# EAGLE schematic ControllerBoard (EAGLE 9.6.2)
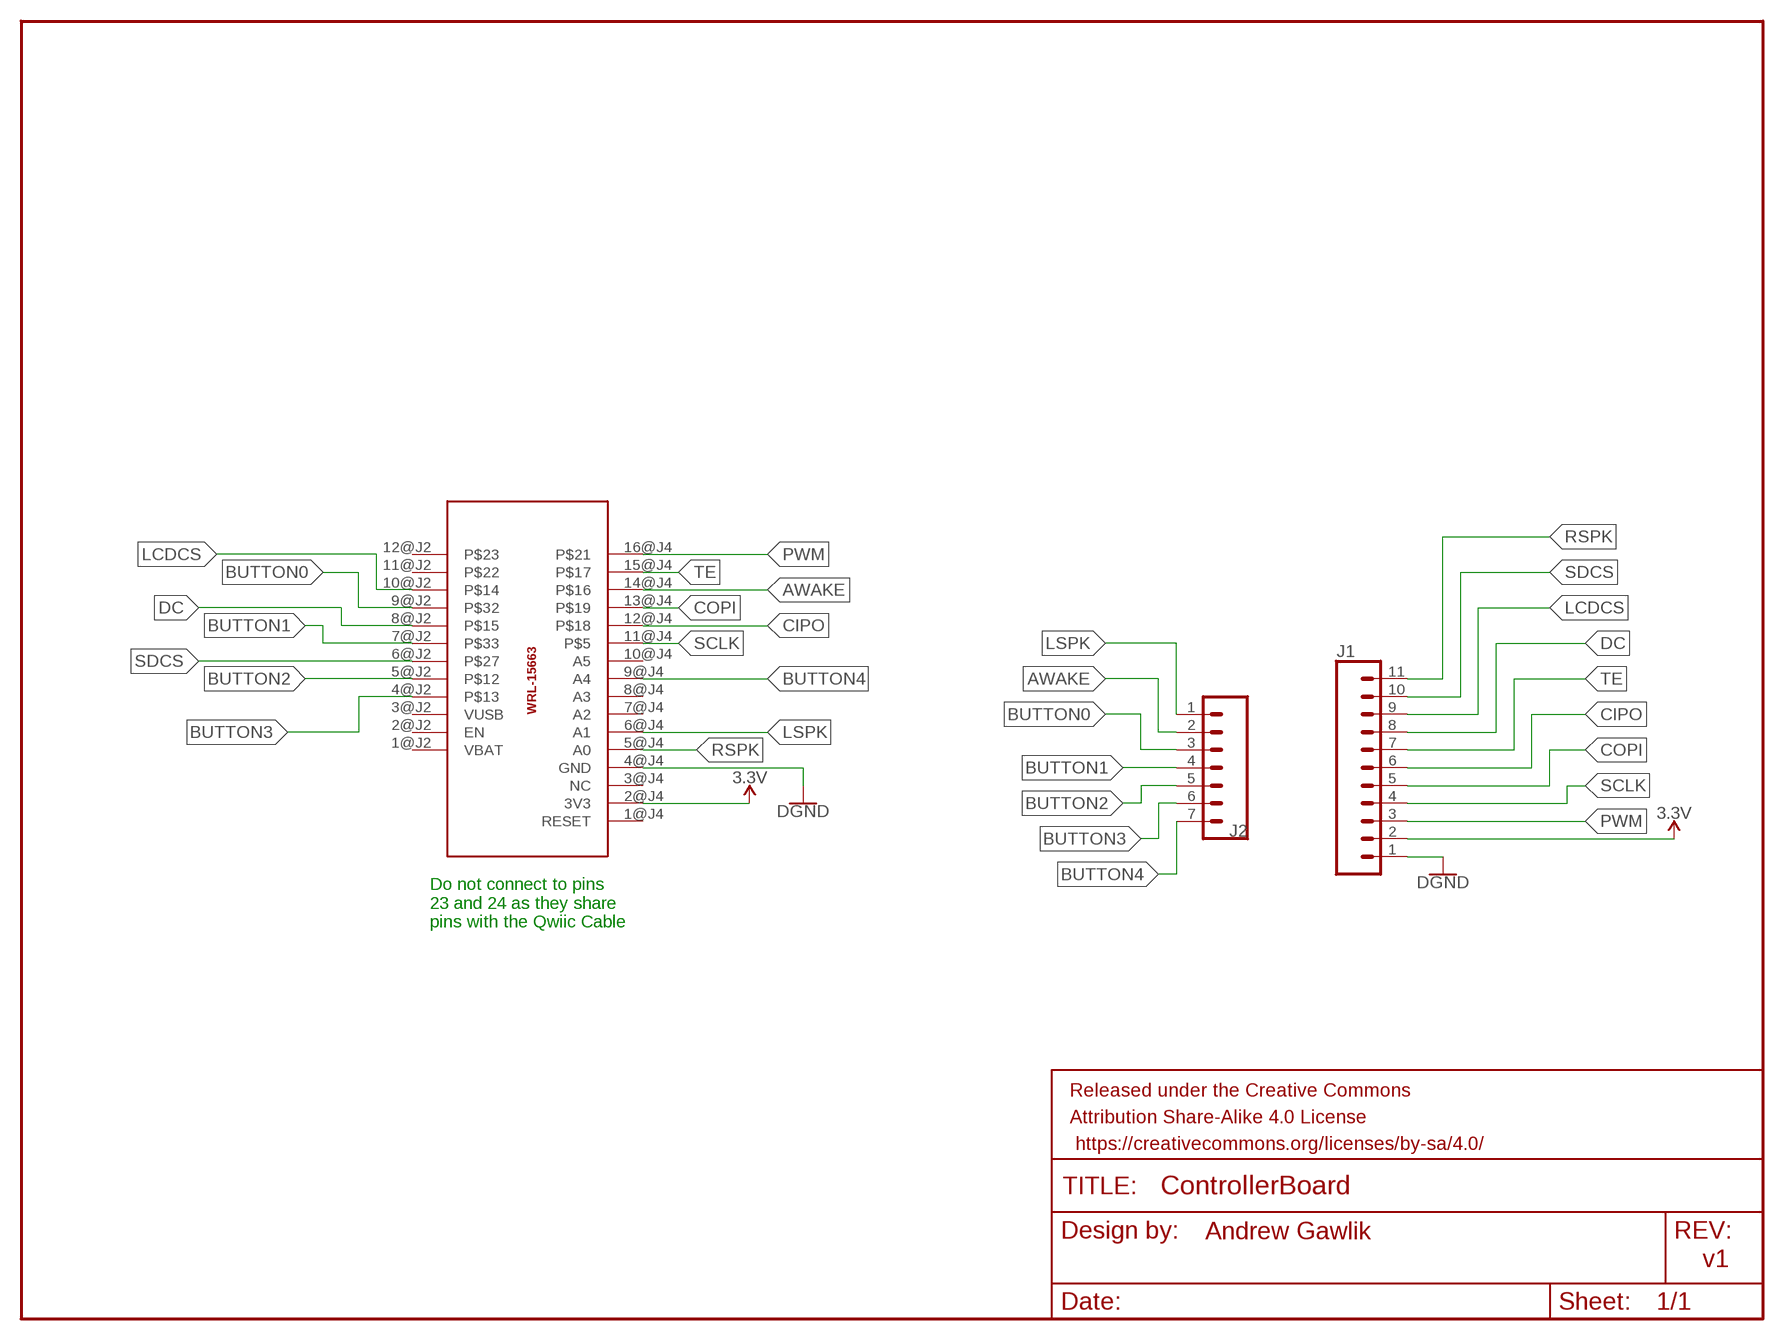
[diagram p0: schematic, sheet 1]

## Parts
A1  ESP32_MICROCONTROLLER  WRL-17381  [WRL-17381]
FRAME1  FRAME-LETTER  [CREATIVE_COMMONS]
J1  CONN_11LOCK  [1X11_LOCK]
J2  CONN_07LOCK  [1X07_LOCK]

## Nets
3.3V: A1.2@J4(3V3) J1.2
AWAKE: A1.14@J4 J2.2
BUTTON0: A1.9@J2 J2.3
BUTTON1: A1.7@J2 J2.4
BUTTON2: A1.5@J2 J2.5
BUTTON3: A1.4@J2 J2.6
BUTTON4: A1.9@J4(A4) J2.7
CIPO: A1.12@J4 J1.6
COPI: A1.13@J4 J1.5
DC: A1.8@J2 J1.8
GND: A1.4@J4(GND) J1.1 ; supply symbol labelled DGND
LCDCS: A1.10@J2 J1.9
LSPK: A1.6@J4(A1) J2.1
PWM: A1.16@J4 J1.3
RSPK: A1.5@J4(A0) J1.11
SCLK: A1.11@J4 J1.4
SDCS: A1.6@J2 J1.10
TE: A1.15@J4 J1.7
Unconnected: A1.1@J2(VBAT) A1.1@J4(RESET) A1.2@J2(EN) A1.3@J2(VUSB) A1.3@J4(NC) A1.7@J4(A2) A1.8@J4(A3) A1.10@J4(A5) A1.11@J2 A1.12@J2

## Notes on the sheet
- Do not connect to pins
  23 and 24 as they share
  pins with the Qwiic Cable
- Andrew Gawlik
- v1

## Library data of the parts
A1 = SparkFunBreakouts:WRL-17381: SparkFun Thing Plus - ESP32 WROOM (U.FL) The SparkFun ESP32 Thing Plus with U.FL is the next step to get started with Espressif IoT ideations while still enjoying all the amenities of the original ESP32 Thing. Espressif's ESP32 WROOM is a powerful WiFi and Bluetooth MCU module that targets a wide variety of applications. At the core of this module is the ESP32-D0WDQ6 chip which is designed to be both scalable and adaptive. To make the Thing Plus even easier to use, we've moved a few pins around to make the board Feather compatible and it utilizes our handy Qwiic Connect System which means no soldering or shields are required to connect it to the rest of your system! Why the name? We lovingly call it the “Thing” because it's the perfect foundation for your Internet of Things project. The Thing does everything from turning on an LED to posting data with your chosen platform, and can be programmed just like any microcontroller. You can even program the Thing through the Arduino IDE by installing the updated ESP32 Arduino Core <https://learn.sparkfun.com/tutorials/esp32-thing-plus-hookup-guide?_ga=2.27845048.500067859.1617115070-1450422450.1611246352#software-setup>. The ESP32 Thing plus integrates a rich set of peripherals, ranging from capacitive touch sensors, Hall sensors, SD card interface, Ethernet, high-speed SPI, UART, I2S and I2C. Thanks to the onboard ESP32 WROOM module, the SparkFun Thing Plus features 16MB of flash memory, 520kB of internal SRAM, an integrated 802.11 BGN WiFi transceiver and dual-mode Bluetooth capabilities, a JST connector to plug in a LiPo battery, and a U.FL connector for your own antenna. The SparkFun Qwiic Connect System is an ecosystem of I2C sensors, actuators, shields and cables that make prototyping faster and less prone to error. All Qwiic-enabled boards use a common 1mm pitch, 4-pin JST connector. This reduces the amount of required PCB space, and polarized connections mean you can’t hook it up wrong.
FRAME1 = SparkFun-Aesthetics:FRAME-LETTER: Schematic Frame - Letter Standard 8.5x11 US Letter frame
J1 = SparkFun-Connectors:CONN_11: Multi connection point. Often used as Generic Header-pin footprint for 0.1 inch spaced/style header connections On any of the 0.1 inch spaced packages, you can populate with these: Break Away Headers - Straight <https://www.sparkfun.com/products/116> (PRT-00116) Break Away Male Headers - Right Angle <https://www.sparkfun.com/products/553> (PRT-00553) Female Headers <https://www.sparkfun.com/products/115> (PRT-00115) Break Away Headers - Machine Pin <https://www.sparkfun.com/products/117> (PRT-00117) Break Away Female Headers - Swiss Machine Pin <https://www.sparkfun.com/products/743> (PRT-00743) For SCREWTERMINALS and SPRING TERMINALS visit here: Screw Terimnals on SparkFun.com <https://www.sparkfun.com/search/results?term=Screw+Terminals> (5mm/3.5mm/2.54mm spacing) This device is also useful as a general connection point to wire up your design to another part of your project. Our various solder wires solder well into these plated through hole pads. Hook-Up Wire - Assortment (Stranded, 22 AWG) <https://www.sparkfun.com/products/11375> (PRT-11375) Hook-Up Wire - Assortment (Solid Core, 22 AWG) <https://www.sparkfun.com/products/11367> (PRT-11367) View the entire wire category on our website here <https://www.sparkfun.com/categories/141>
J2 = SparkFun-Connectors:CONN_07: Multi connection point. Often used as Generic Header-pin footprint for 0.1 inch spaced/style header connections On any of the 0.1 inch spaced packages, you can populate with these: Break Away Headers - Straight <https://www.sparkfun.com/products/116> (PRT-00116) Break Away Male Headers - Right Angle <https://www.sparkfun.com/products/553> (PRT-00553) Female Headers <https://www.sparkfun.com/products/115> (PRT-00115) Break Away Headers - Machine Pin <https://www.sparkfun.com/products/117> (PRT-00117) Break Away Female Headers - Swiss Machine Pin <https://www.sparkfun.com/products/743> (PRT-00743) For SCREWTERMINALS and SPRING TERMINALS visit here: Screw Terimnals on SparkFun.com <https://www.sparkfun.com/search/results?term=Screw+Terminals> (5mm/3.5mm/2.54mm spacing) This device is also useful as a general connection point to wire up your design to another part of your project. Our various solder wires solder well into these plated through hole pads. Hook-Up Wire - Assortment (Stranded, 22 AWG) <https://www.sparkfun.com/products/11375> (PRT-11375) Hook-Up Wire - Assortment (Solid Core, 22 AWG) <https://www.sparkfun.com/products/11367> (PRT-11367) View the entire wire category on our website here <https://www.sparkfun.com/categories/141> Special notes: Molex polarized connector foot print use with SKU : PRT-08231 with associated crimp pins and housings. 1MM SMD Version SKU: PRT-10208 NOTES ON THE VARIANTS LOCK and LOCK_LONGPADS... This footprint was designed to help hold the alignment of a through-hole component (i.e. 6-pin header) while soldering it into place. You may notice that each hole has been shifted either up or down by 0.005 of an inch from it's more standard position (which is a perfectly straight line). This slight alteration caused the pins (the squares in the middle) to touch the edges of the holes. Because they are alternating, it causes a "brace" to hold the component in place. 0.005 has proven to be the perfect amount of "off-center" position when using our standard breakaway headers. Although looks a little odd when you look at the bare footprint, once you have a header in there, the alteration is very hard to notice. Also,if you push a header all the way into place, it is covered up entirely on the bottom side.